# Altium schematic sheet Back.SchDoc
size A
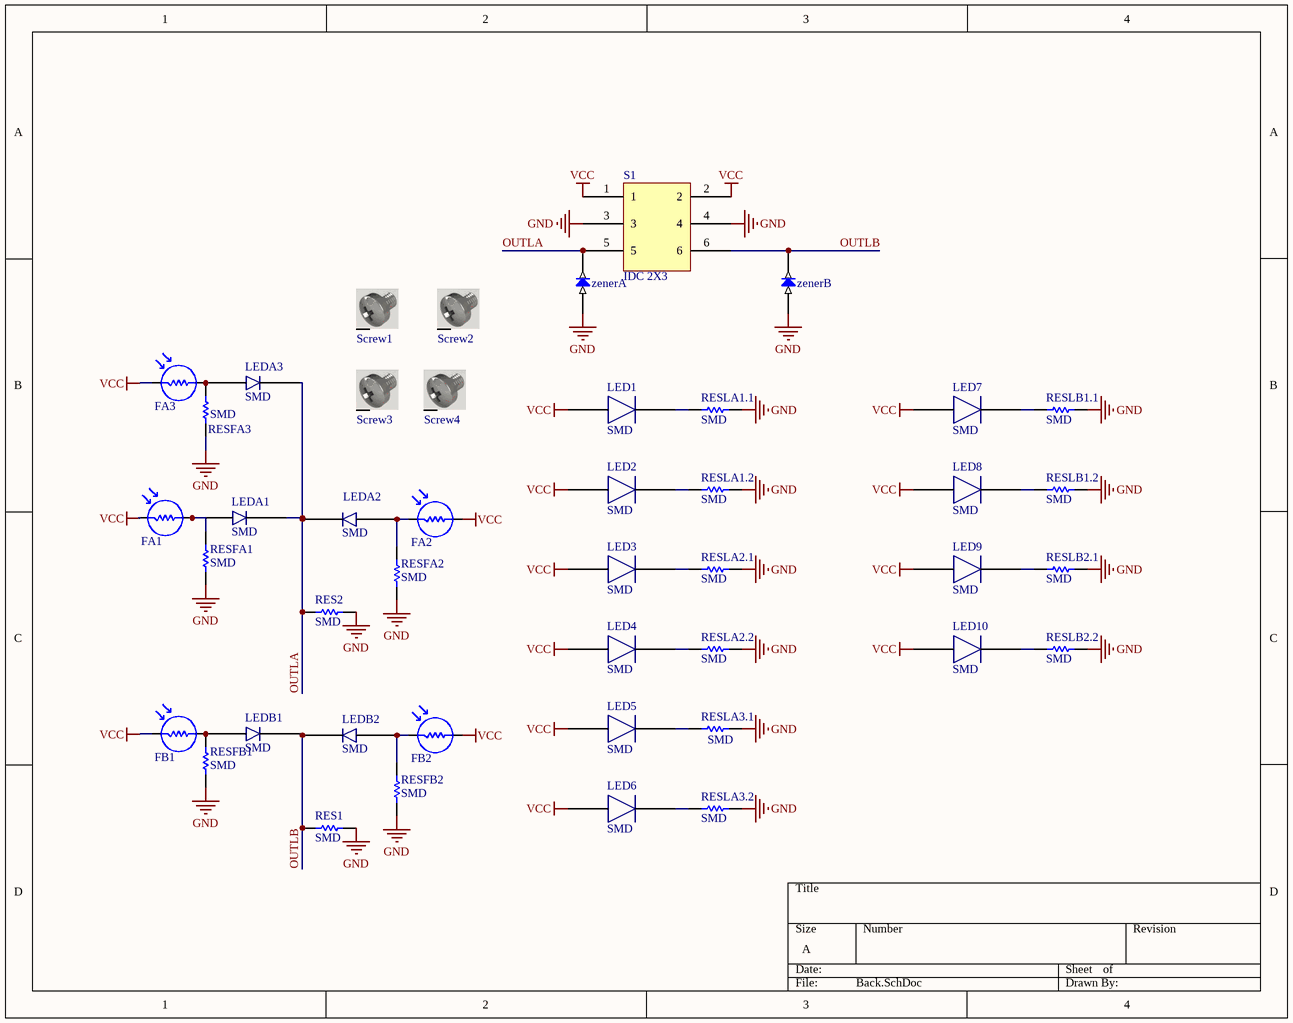
[diagram p0: Back.SchDoc]

## Parts
FA1  Photo Cell  [PhotoCell.]  (value not drawn)
FA2  Photo Cell  [PhotoCell.]  (value not drawn)
FA3  Photo Cell  [PhotoCell.]  (value not drawn)
FB1  Photo Cell  [PhotoCell.]  (value not drawn)
FB2  Photo Cell  [PhotoCell.]  (value not drawn)
LED1  SMD  [LED SMD]
LED2  SMD  [LED SMD]
LED3  SMD  [LED SMD]
LED4  SMD  [LED SMD]
LED5  SMD  [LED SMD]
LED6  SMD  [LED SMD]
LED7  SMD  [LED SMD]
LED8  SMD  [LED SMD]
LED9  SMD  [LED SMD]
LED10  SMD  [LED SMD]
LEDA1  SMD  [LED SMD]
LEDA2  SMD  [LED SMD]
LEDA3  SMD  [LED SMD]
LEDB1  SMD  [LED SMD]
LEDB2  SMD  [LED SMD]
RES1  SMD  [Resistor SMD 1206]
RES2  SMD  [Resistor SMD 1206]
RESFA1  SMD  [Resistor SMD 1206]
RESFA2  SMD  [Resistor SMD 1206]
RESFA3  SMD  [Resistor SMD 1206]
RESFB1  SMD  [Resistor SMD 1206]
RESFB2  SMD  [Resistor SMD 1206]
RESLA1.1  SMD  [Resistor SMD 1206]
RESLA1.2  SMD  [Resistor SMD 1206]
RESLA2.1  SMD  [Resistor SMD 1206]
RESLA2.2  SMD  [Resistor SMD 1206]
RESLA3.1  SMD  [Resistor SMD 1206]
RESLA3.2  SMD  [Resistor SMD 1206]
RESLB1.1  SMD  [Resistor SMD 1206]
RESLB1.2  SMD  [Resistor SMD 1206]
RESLB2.1  SMD  [Resistor SMD 1206]
RESLB2.2  SMD  [Resistor SMD 1206]
S1  IDC 2X3  [IDC 2X3]
Screw1  Screw  [Screw]  (value not drawn)
Screw2  Screw  [Screw]  (value not drawn)
Screw3  Screw  [Screw]  (value not drawn)
Screw4  Screw  [Screw]  (value not drawn)
zenerA  zener  [LED SMD]  (value not drawn)
zenerB  zener  [LED SMD]  (value not drawn)

## Nets
GND: RES1.2 RES2.2 RESFA1.1 RESFA2.1 RESFA3.1 RESFB1.1 RESFB2.1 RESLA1.1.2 RESLA1.2.2 RESLA2.1.2 RESLA2.2.2 RESLA3.1.2 RESLA3.2.2 RESLB1.1.2 RESLB1.2.2 RESLB2.1.2 RESLB2.2.2 S1.3 S1.4 zenerA.1(in) zenerB.1(in)
VCC: FA1.1 FA2.2 FA3.1 FB1.1 FB2.2 LED1.1 LED2.1 LED3.1 LED4.1 LED5.1 LED6.1 LED7.1 LED8.1 LED9.1 LED10.1 S1.1 S1.2
OUTLA: LEDA1.2 LEDA2.2 LEDA3.2 RES2.1 S1.5 zenerA.2(out)
OUTLB: LEDB1.2 LEDB2.2 RES1.1 S1.6 zenerB.2(out)
NetFA1_2: FA1.2 LEDA1.1 RESFA1.2
NetFA2_1: FA2.1 LEDA2.1 RESFA2.2
NetFA3_2: FA3.2 LEDA3.1 RESFA3.2
NetFB1_2: FB1.2 LEDB1.1 RESFB1.2
NetFB2_1: FB2.1 LEDB2.1 RESFB2.2
NetLED1_2: LED1.2 RESLA1.1.1
NetLED2_2: LED2.2 RESLA1.2.1
NetLED3_2: LED3.2 RESLA2.1.1
NetLED4_2: LED4.2 RESLA2.2.1
NetLED5_2: LED5.2 RESLA3.1.1
NetLED6_2: LED6.2 RESLA3.2.1
NetLED7_2: LED7.2 RESLB1.1.1
NetLED8_2: LED8.2 RESLB1.2.1
NetLED9_2: LED9.2 RESLB2.1.1
NetLED10_2: LED10.2 RESLB2.2.1

Not connected (* = marked no-connect by the designer): Screw1 S; Screw2 S; Screw3 S; Screw4 S

## Library data of the parts
FA1-FA3 FB1 FB2 = Photo Cell..: LatestRevisionDate: 17-Jul-2002; LatestRevisionNote: Re-released for DXP Platform.; Publisher: Altium Limited
LED1-LED10 LEDA1-LEDA3 LEDB1 LEDB2 = LED SMD
RES1 RES2 RESFA1-RESFA3 RESFB1 RESFB2 RESLA1.1 RESLA1.2 RESLA2.1 RESLA2.2 RESLA3.1 RESLA3.2 RESLB1.1 RESLB1.2 RESLB2.1 RESLB2.2 = Res SMD
zenerA zenerB = SMDZenerDiode
Screw1-Screw4 = Screw: LatestRevisionDate: 17-Jul-2002; LatestRevisionNote: Re-released for DXP Platform.; Publisher: Altium Limited